# Altium schematic sheet nusense-power.schdoc: NUSense
size A4; Organization: Elby Designs; Address1: 9 Follan Close; Address2: Kariong; Address3: NSW 2250; Address4: Australia; Revision: 1; SheetNumber: 8; SheetTotal: 9; DrawnBy: Power Supply; Engineer: Laurie Biddulph; PageSetup: Record=PageOptions|CenterHorizontal=True|CenterVertical=True|PrintScale=1.38|XCorrection=1.00|YCorrection=1.00|PrintKind=1|BorderSize=5000000|LeftOffset=0|BottomOffset=0|Orientation=2|PaperLength=1000|PaperWidth=1000|Scale=100|PaperSource=7|PrintQuality=-4|MediaType=1|DitherType=10|PaperKind=A3|PrintScaleMode=1
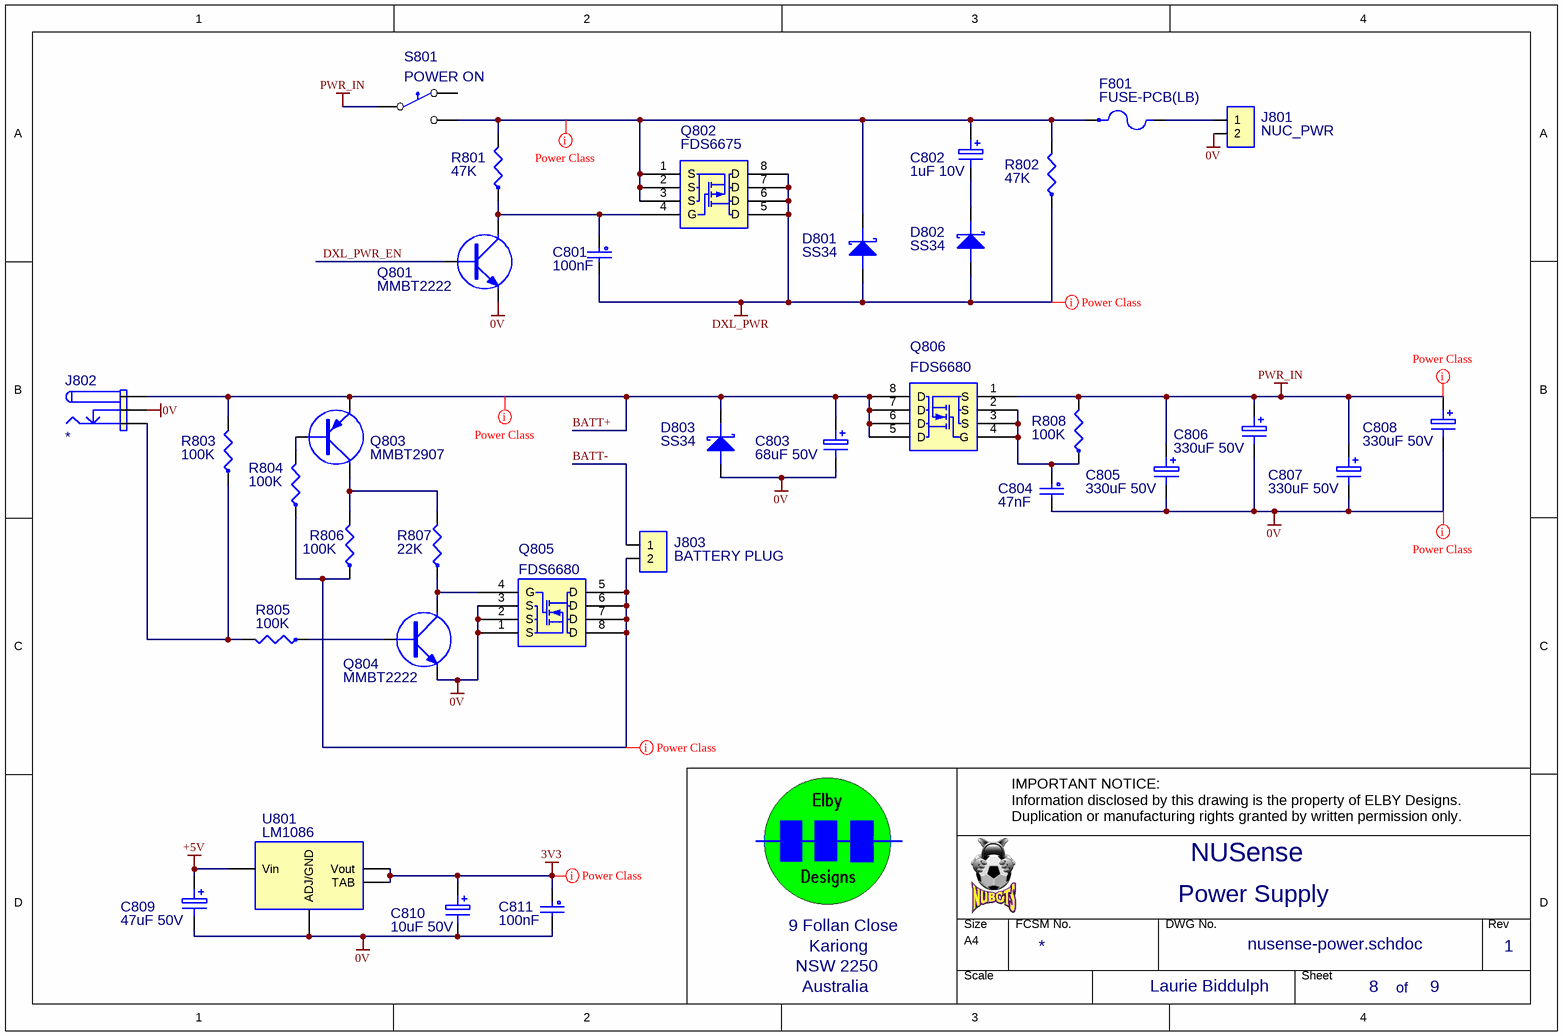
[diagram p0: nusense-power.schdoc]

## Parts
C801  100nF  [RAD-0.2N(LB)]
C802  1uF 10V  [RB-D5.0-P2.0]
C803  68uF 50V  [RB-D6.3-P2.5]
C804  47nF  [RAD-0.2(LB)]
C805  330uF 50V  [RB-D6.3-P2.5]
C806  330uF 50V  [RB-D6.3-P2.5]
C807  330uF 50V  [RB-D6.3-P2.5]
C808  330uF 50V  [RB-D6.3-P2.5]
C809  47uF 50V  [RB-D6.3-P2.5]
C810  10uF 50V  [RB-D6.3-P2.5]
C811  100nF  [RAD-0.2N(LB)]
D801  SS34  [DO-214AB (SMC)]
D802  SS34  [DO-214AB (SMC)]
D803  SS34  [DO-214AB (SMC)]
F801  FUSE-PCB(LB)  [FUSE20MM(LB)]
J801  NUC_PWR  [TERM254-2(LB)]
J802  *  [PCB-DC-SOCKET]
J803  BATTERY PLUG  [TERM254-2(LB)]
Q801  MMBT2222  [SOT-23(LB)]
Q802  FDS6675  [SO-8]
Q803  MMBT2907  [SOT-23(LB)]
Q804  MMBT2222  [SOT-23(LB)]
Q805  FDS6680  [SO-8]
Q806  FDS6680  [SO-8]
R801  47K  [AXIAL-0.4(LB)]
R802  47K  [AXIAL-0.4(LB)]
R803  100K  [AXIAL-0.4(LB)]
R804  100K  [AXIAL-0.4(LB)]
R805  100K  [AXIAL-0.4(LB)]
R806  100K  [AXIAL-0.4(LB)]
R807  22K  [AXIAL-0.4(LB)]
R808  100K  [AXIAL-0.4(LB)]
S801  POWER ON  [SW-SPDT-SLIDE-RA(LB)]
U801  LM1086  [TO220-VHS-B(LB)]

## Nets
0V: C803.2 C804.2 C805.2 C806.2 C807.2 C808.2 C809.2 C810.2 C811.2 D803.A J801.2 J802.2(SWITCHED-BODY) Q801.2(E) Q804.2(E) Q805.1(S) Q805.2(S) Q805.3(S) U801.1(ADJ/GND)
3V3: C810.1 C811.1 U801.2(Vout) U801.TAB
+5V: C809.1 U801.3(Vin)
DXL_PWR: C801.2 D801.A D802.A Q802.5(D) Q802.6(D) Q802.7(D) Q802.8(D) R802.1
PWR_IN: C805.1 C806.1 C807.1 C808.1 Q806.1(S) R808.2 S801.1(COM)
BATT+: C803.1 D803.K J802.1(TIP) Q803.2(E) Q806.5(D) Q806.6(D) Q806.7(D) Q806.8(D) R803.2
BATT-: J803.1
DXL_PWR_EN: Q801.1(B)
NetC801_1: C801.1 Q801.3(C) Q802.4(G) R801.1
NetC802_1: C802.1 D801.K F801.1 Q802.1(S) Q802.2(S) Q802.3(S) R801.2 R802.2 S801.2(NO)
NetC802_2: C802.2 D802.K
NetC804_1: C804.1 Q806.2(S) Q806.3(S) Q806.4(G) R808.1
NetF801_2: F801.2 J801.1
NetJ802_3: J802.3(Body) R803.1 R805.2
NetJ803_2: J803.2 Q805.5(D) Q805.6(D) Q805.7(D) Q805.8(D) R804.1 R806.1
NetQ803_1: Q803.1(B) R804.2
NetQ803_3: Q803.3(C) R806.2 R807.2
NetQ804_1: Q804.1(B) R805.1
NetQ804_3: Q804.3(C) Q805.4(G) R807.1

Not connected (* = marked no-connect by the designer): S801 3(NC)

## Layout directives
net class PowerClass: 0V, 3V3, BATT+, DXL_PWR, NetC802_1, NetJ803_2, PWR_IN

## Notes on the sheet
- IMPORTANT NOTICE:
  Information disclosed by this drawing is the property of ELBY Designs.
  Duplication or manufacturing rights granted by written permission only.
- of

## Library data of the parts
C801 C811 = CC-100NF(LB): Monolithic Ceramic; EMRP: CC-100NF
C802 = CE-1UF50V(LB): 20% 50V Aluminium Electrolytic; EMRP: CE-1UF
C803 = CE-68UF50V(LB): 20% 50V Aluminium Electrolytic; EMRP: CE-47UF
C804 = CP-47NF(LB): 63V 10% Metallised Polyester; EMRP: CP-47NF
C805-C808 = CE-330UF50V(LB): 20% 50V Aluminium Electrolytic; EMRP: CE-47UF
C809 = CE-47UF50V(LB): 20% 50V Aluminium Electrolytic; EMRP: CE-47UF
C810 = CE-10UF50V(LB): 20% 50V Aluminium Electrolytic; EMRP: CE-10UF
D801-D803 = SS34(LB): 40V, 3A Sschottky Rectifier; Text Field1: 330*101040
F801 = FUSE-PCB(LB): PCB Fuse Holder and Fuse
J801 J803 = CON2(LB): Text Field2: HM-3412 + HM-3402
J802 = DC2.5MM-PCBV(LB): Switched 2.5mm DC Connector - PCB; EMRP: JP-2.5MM-PAN
Q801 Q804 = MMBT2222(SMD): NPN Transistor; EMRP: SM-T-MMBT2222
Q802 = FDS6675: 40V P-Channel PowerTrench MOSFET; Text Field1: 340*101620; Comment_1: *
Q803 = MMBT2907(SMD): PNP Transistor; EMRP: SM-T-MMBT2907
Q805 Q806 = FDS6680: 30V N-Channel PowerTrench MOSFET; Comment_1: *
R801 R802 = RM-47K(LB): 0.5W 1% Metal Film Resistor; EMRP: RM-47K
R803-R806 R808 = RM-100K(LB): 0.5W 1% Metal Film Resistor; EMRP: RM-100K
R807 = RM-22K(LB): 0.5W 1% Metal Film Resistor; EMRP: RM-22K
S801 = SW-SPDT_11(LB): Single-pole, Double-throw Switch
U801 = LM1086(LB): 3-terminal Positive Voltage Regulator; Text Field1: 347-6870; Text Field2: ZV-1615; Text Field3: 512-KA317